# EAGLE design SHIELD_STM32F426ZI (EAGLE 9.5.1)

## Sheet 1 of 2
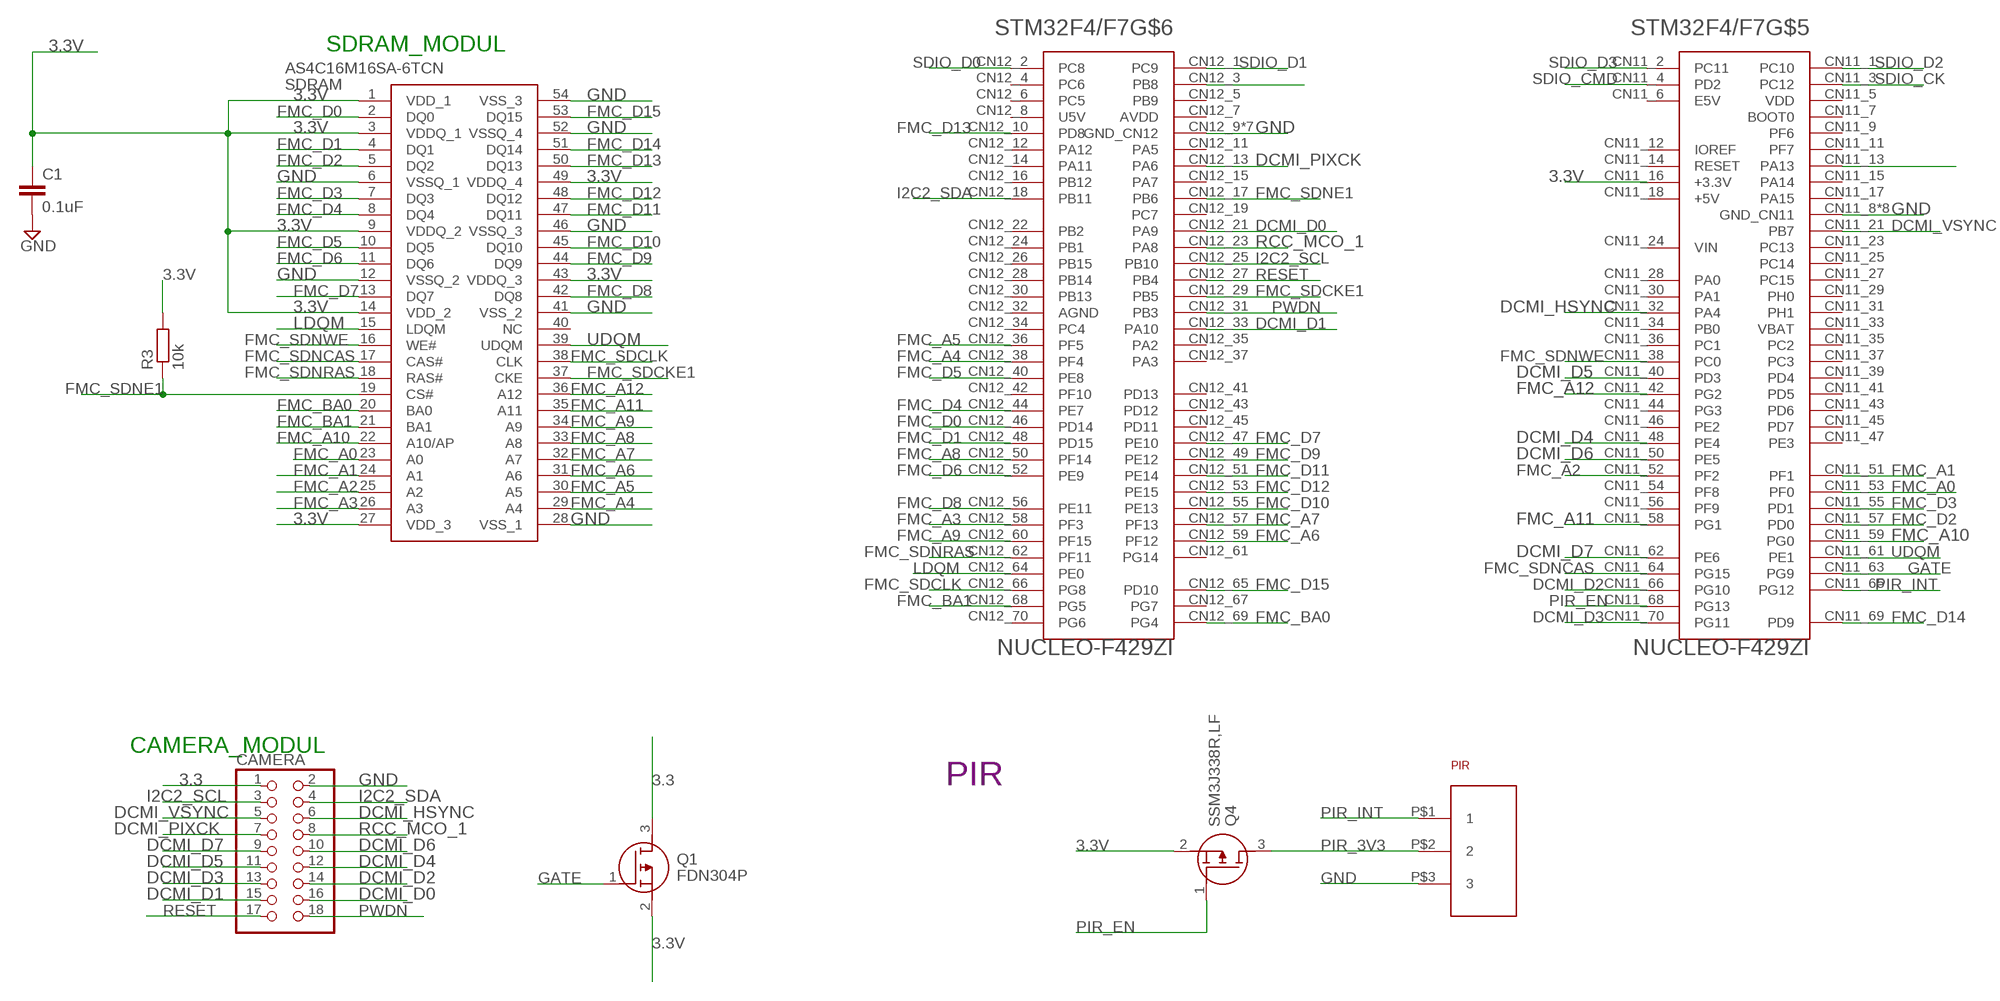
[diagram p0: schematic, sheet 1]

### Parts
C1  0.1uF  C-EUC0402K  [C0402K]
CAMERA  0  PINHD-2X9  [2X09]
PIR  SENBA_PIR_3PIN  [SENBA_PIR]
Q1  FDN304P  [SOT95P237X112-3N]
Q4  SSM3J338R,LF  [SSM3J332RLFT]
R3  10k  R_0402WEB_0402  [C0402K]
SDRAM  AS4C16M16SA-6TCN  [SOP80P1176X120-54N]
STM32F4/F7  NUCLEO-F429ZI  [MODULE_NUCLEO-F429ZI]

### Nets
3.3: CAMERA.1 Q1.3(D)
3.3V: C1.1 Q1.2(S) Q4.2(S) R3.2 SDRAM.1(VDD_1) SDRAM.3(VDDQ_1) SDRAM.9(VDDQ_2) SDRAM.14(VDD_2) SDRAM.27(VDD_3) SDRAM.43(VDDQ_3) SDRAM.49(VDDQ_4) STM32F4/F7.CN11_16(+3.3V) ; also sheet 2
CARD_DET: STM32F4/F7.CN12_3(PB8) ; also sheet 2
DCMI_D0: CAMERA.16 STM32F4/F7.CN12_21(PA9)
DCMI_D1: CAMERA.15 STM32F4/F7.CN12_33(PA10)
DCMI_D2: CAMERA.14 STM32F4/F7.CN11_66(PG10)
DCMI_D3: CAMERA.13 STM32F4/F7.CN11_70(PG11)
DCMI_D4: CAMERA.12 STM32F4/F7.CN11_48(PE4)
DCMI_D5: CAMERA.11 STM32F4/F7.CN11_40(PD3)
DCMI_D6: CAMERA.10 STM32F4/F7.CN11_50(PE5)
DCMI_D7: CAMERA.9 STM32F4/F7.CN11_62(PE6)
DCMI_HSYNC: CAMERA.6 STM32F4/F7.CN11_32(PA4)
DCMI_PIXCK: CAMERA.7 STM32F4/F7.CN12_13(PA6)
DCMI_VSYNC: CAMERA.5 STM32F4/F7.CN11_21(PB7)
FMC_A0: SDRAM.23(A0) STM32F4/F7.CN11_53(PF0)
FMC_A1: SDRAM.24(A1) STM32F4/F7.CN11_51(PF1)
FMC_A2: SDRAM.25(A2) STM32F4/F7.CN11_52(PF2)
FMC_A3: SDRAM.26(A3) STM32F4/F7.CN12_58(PF3)
FMC_A4: SDRAM.29(A4) STM32F4/F7.CN12_38(PF4)
FMC_A5: SDRAM.30(A5) STM32F4/F7.CN12_36(PF5)
FMC_A6: SDRAM.31(A6) STM32F4/F7.CN12_59(PF12)
FMC_A7: SDRAM.32(A7) STM32F4/F7.CN12_57(PF13)
FMC_A8: SDRAM.33(A8) STM32F4/F7.CN12_50(PF14)
FMC_A9: SDRAM.34(A9) STM32F4/F7.CN12_60(PF15)
FMC_A10: SDRAM.22(A10/AP) STM32F4/F7.CN11_59(PG0)
FMC_A11: SDRAM.35(A11) STM32F4/F7.CN11_58(PG1)
FMC_A12: SDRAM.36(A12) STM32F4/F7.CN11_42(PG2)
FMC_BA0: SDRAM.20(BA0) STM32F4/F7.CN12_69(PG4)
FMC_BA1: SDRAM.21(BA1) STM32F4/F7.CN12_68(PG5)
FMC_D0: SDRAM.2(DQ0) STM32F4/F7.CN12_46(PD14)
FMC_D1: SDRAM.4(DQ1) STM32F4/F7.CN12_48(PD15)
FMC_D2: SDRAM.5(DQ2) STM32F4/F7.CN11_57(PD0)
FMC_D3: SDRAM.7(DQ3) STM32F4/F7.CN11_55(PD1)
FMC_D4: SDRAM.8(DQ4) STM32F4/F7.CN12_44(PE7)
FMC_D5: SDRAM.10(DQ5) STM32F4/F7.CN12_40(PE8)
FMC_D6: SDRAM.11(DQ6) STM32F4/F7.CN12_52(PE9)
FMC_D7: SDRAM.13(DQ7) STM32F4/F7.CN12_47(PE10)
FMC_D8: SDRAM.42(DQ8) STM32F4/F7.CN12_56(PE11)
FMC_D9: SDRAM.44(DQ9) STM32F4/F7.CN12_49(PE12)
FMC_D10: SDRAM.45(DQ10) STM32F4/F7.CN12_55(PE13)
FMC_D11: SDRAM.47(DQ11) STM32F4/F7.CN12_51(PE14)
FMC_D12: SDRAM.48(DQ12) STM32F4/F7.CN12_53(PE15)
FMC_D13: SDRAM.50(DQ13) STM32F4/F7.CN12_10(PD8)
FMC_D14: SDRAM.51(DQ14) STM32F4/F7.CN11_69(PD9)
FMC_D15: SDRAM.53(DQ15) STM32F4/F7.CN12_65(PD10)
FMC_SDCKE1: SDRAM.37(CKE) STM32F4/F7.CN12_29(PB5)
FMC_SDCLK: SDRAM.38(CLK) STM32F4/F7.CN12_66(PG8)
FMC_SDNCAS: SDRAM.17(CAS#) STM32F4/F7.CN11_64(PG15)
FMC_SDNE1: R3.1 SDRAM.19(CS#) STM32F4/F7.CN12_17(PB6)
FMC_SDNRAS: SDRAM.18(RAS#) STM32F4/F7.CN12_62(PF11)
FMC_SDNWE: SDRAM.16(WE#) STM32F4/F7.CN11_38(PC0)
GATE: Q1.1(G) STM32F4/F7.CN11_63(PG9)
GND: C1.2 CAMERA.2 PIR.P$3 SDRAM.6(VSSQ_1) SDRAM.12(VSSQ_2) SDRAM.28(VSS_1) SDRAM.41(VSS_2) SDRAM.46(VSSQ_3) SDRAM.52(VSSQ_4) SDRAM.54(VSS_3) STM32F4/F7.CN11_8(GND_CN11) STM32F4/F7.CN11_19(GND_CN11) STM32F4/F7.CN11_20(GND_CN11) STM32F4/F7.CN11_22(GND_CN11) STM32F4/F7.CN11_49(GND_CN11) STM32F4/F7.CN11_60(GND_CN11) STM32F4/F7.CN11_71(GND_CN11) STM32F4/F7.CN11_72(GND_CN11) STM32F4/F7.CN12_9(GND_CN12) STM32F4/F7.CN12_20(GND_CN12) STM32F4/F7.CN12_39(GND_CN12) STM32F4/F7.CN12_54(GND_CN12) STM32F4/F7.CN12_63(GND_CN12) STM32F4/F7.CN12_71(GND_CN12) STM32F4/F7.CN12_72(GND_CN12) ; also sheet 2
I2C2_SCL: CAMERA.3 STM32F4/F7.CN12_25(PB10) ; also sheet 2
I2C2_SDA: CAMERA.4 STM32F4/F7.CN12_18(PB11) ; also sheet 2
LDQM: SDRAM.15(LDQM) STM32F4/F7.CN12_64(PE0)
MOSFET_SDCARD: STM32F4/F7.CN11_13(PA13) ; also sheet 2
PIR_3V3: PIR.P$2 Q4.3(D)
PIR_EN: Q4.1(G) STM32F4/F7.CN11_68(PG13)
PIR_INT: PIR.P$1 STM32F4/F7.CN11_65(PG12)
PWDN: CAMERA.18 STM32F4/F7.CN12_31(PB3)
RCC_MCO_1: CAMERA.8 STM32F4/F7.CN12_23(PA8)
RESET: CAMERA.17 STM32F4/F7.CN12_27(PB4)
SDIO_CK: STM32F4/F7.CN11_3(PC12) ; also sheet 2
SDIO_CMD: STM32F4/F7.CN11_4(PD2) ; also sheet 2
SDIO_D0: STM32F4/F7.CN12_2(PC8) ; also sheet 2
SDIO_D1: STM32F4/F7.CN12_1(PC9) ; also sheet 2
SDIO_D2: STM32F4/F7.CN11_1(PC10) ; also sheet 2
SDIO_D3: STM32F4/F7.CN11_2(PC11) ; also sheet 2
UDQM: SDRAM.39(UDQM) STM32F4/F7.CN11_61(PE1)
Unconnected: SDRAM.40(NC) STM32F4/F7.CN11_5(VDD) STM32F4/F7.CN11_6(E5V) STM32F4/F7.CN11_7(BOOT0) STM32F4/F7.CN11_9(PF6) STM32F4/F7.CN11_11(PF7) STM32F4/F7.CN11_12(IOREF) STM32F4/F7.CN11_14(RESET) STM32F4/F7.CN11_15(PA14) STM32F4/F7.CN11_17(PA15) STM32F4/F7.CN11_18(+5V) STM32F4/F7.CN11_23(PC13) STM32F4/F7.CN11_24(VIN) STM32F4/F7.CN11_25(PC14) STM32F4/F7.CN11_27(PC15) STM32F4/F7.CN11_28(PA0) STM32F4/F7.CN11_29(PH0) STM32F4/F7.CN11_30(PA1) STM32F4/F7.CN11_31(PH1) STM32F4/F7.CN11_33(VBAT) STM32F4/F7.CN11_34(PB0) STM32F4/F7.CN11_35(PC2) STM32F4/F7.CN11_36(PC1) STM32F4/F7.CN11_37(PC3) STM32F4/F7.CN11_39(PD4) STM32F4/F7.CN11_41(PD5) STM32F4/F7.CN11_43(PD6) STM32F4/F7.CN11_44(PG3) STM32F4/F7.CN11_45(PD7) STM32F4/F7.CN11_46(PE2) STM32F4/F7.CN11_47(PE3) STM32F4/F7.CN11_54(PF8) STM32F4/F7.CN11_56(PF9) STM32F4/F7.CN12_4(PC6) STM32F4/F7.CN12_5(PB9) STM32F4/F7.CN12_6(PC5) STM32F4/F7.CN12_7(AVDD) STM32F4/F7.CN12_8(U5V) STM32F4/F7.CN12_11(PA5) STM32F4/F7.CN12_12(PA12) STM32F4/F7.CN12_14(PA11) STM32F4/F7.CN12_15(PA7) STM32F4/F7.CN12_16(PB12) STM32F4/F7.CN12_19(PC7) STM32F4/F7.CN12_22(PB2) STM32F4/F7.CN12_24(PB1) STM32F4/F7.CN12_26(PB15) STM32F4/F7.CN12_28(PB14) STM32F4/F7.CN12_30(PB13) STM32F4/F7.CN12_32(AGND) STM32F4/F7.CN12_34(PC4) STM32F4/F7.CN12_35(PA2) STM32F4/F7.CN12_37(PA3) STM32F4/F7.CN12_41(PD13) STM32F4/F7.CN12_42(PF10) STM32F4/F7.CN12_43(PD12) STM32F4/F7.CN12_45(PD11) STM32F4/F7.CN12_61(PG14) STM32F4/F7.CN12_67(PG7) STM32F4/F7.CN12_70(PG6)

### Notes on the sheet
- SDRAM_MODUL
- CAMERA_MODUL
- PIR

## Sheet 2 of 2: SDCARD
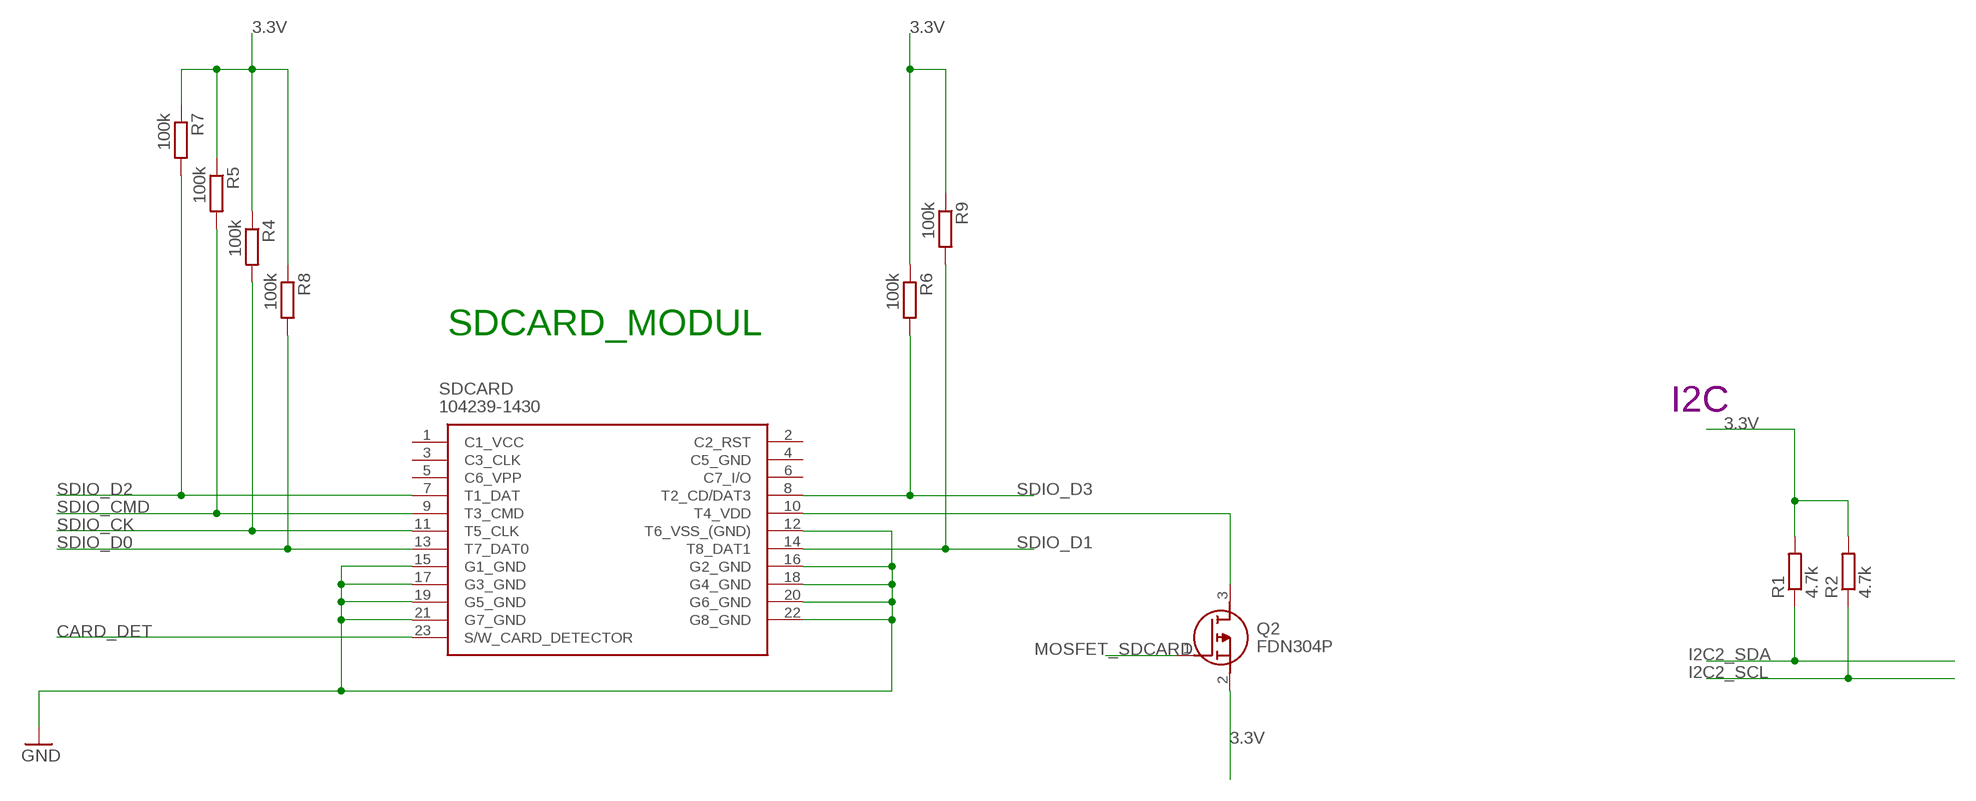
[diagram p1: schematic, sheet 2]

### Parts
Q2  FDN304P  [SOT95P237X112-3N]
R1  4.7k  R_0402WEB_0402  [C0402K]
R2  4.7k  R_0402WEB_0402  [C0402K]
R4  100k  R-EU_R0402  [R0402]
R5  100k  R-EU_R0402  [R0402]
R6  100k  R-EU_R0402  [R0402]
R7  100k  R-EU_R0402  [R0402]
R8  100k  R-EU_R0402  [R0402]
R9  100k  R-EU_R0402  [R0402]
SDCARD  104239-1430  [1042391430]

### Nets
3.3V: Q2.2(S) R1.2 R2.2 R4.1 R5.1 R6.1 R7.1 R8.1 R9.1 ; also sheet 1
CARD_DET: SDCARD.23(S/W_CARD_DETECTOR) ; also sheet 1
GND: SDCARD.12(T6_VSS_(GND)) SDCARD.15(G1_GND) SDCARD.16(G2_GND) SDCARD.17(G3_GND) SDCARD.18(G4_GND) SDCARD.19(G5_GND) SDCARD.20(G6_GND) SDCARD.21(G7_GND) SDCARD.22(G8_GND) ; also sheet 1
I2C2_SCL: R2.1 ; also sheet 1
I2C2_SDA: R1.1 ; also sheet 1
MOSFET_SDCARD: Q2.1(G) ; also sheet 1
N$1: Q2.3(D) SDCARD.10(T4_VDD)
SDIO_CK: R4.2 SDCARD.11(T5_CLK) ; also sheet 1
SDIO_CMD: R5.2 SDCARD.9(T3_CMD) ; also sheet 1
SDIO_D0: R8.2 SDCARD.13(T7_DAT0) ; also sheet 1
SDIO_D1: R9.2 SDCARD.14(T8_DAT1) ; also sheet 1
SDIO_D2: R7.2 SDCARD.7(T1_DAT) ; also sheet 1
SDIO_D3: R6.2 SDCARD.8(T2_CD/DAT3) ; also sheet 1
Unconnected: SDCARD.1(C1_VCC) SDCARD.2(C2_RST) SDCARD.3(C3_CLK) SDCARD.4(C5_GND) SDCARD.5(C6_VPP) SDCARD.6(C7_I/O)

### Notes on the sheet
- SDCARD_MODUL
- I2C

## Library data of the parts
C1 = rcl:C-EU: CAPACITOR, European symbol; SPICEPREFIX: C
CAMERA = pinhead:PINHD-2X9: PIN HEADER
PIR = sicom_universal:SENBA_PIR_3PIN
Q1 Q2 = FDN304P:FDN304P: FDN304P P-Channel MOSFET, 2.4 A, 20 V PowerTrench, 3-Pin SOT-23 ON Semiconductor Source: Datasheet <https://componentsearchengine.com/Datasheets/1/FDN304P.pdf>; DESCRIPTION: FDN304P P-Channel MOSFET, 2.4 A, 20 V PowerTrench, 3-Pin SOT-23 ON Semiconductor; HEIGHT: 1.12mm; MANUFACTURER_NAME: ON Semiconductor; MANUFACTURER_PART_NUMBER: FDN304P; MOUSER_PART_NUMBER: 512-FDN304P; MOUSER_PRICE-STOCK: https://www.mouser.com/Search/Refine.aspx?Keyword=512-FDN304P
Q4 = SamacSys_Parts:SSM3J338R,LF: MOSFET Small-signal MOSFET Vdss= -12V, ID= -6A Source: Datasheet <https://componentsearchengine.com/Datasheets/1/SSM3J338R,LF.pdf>; DESCRIPTION: MOSFET Small-signal MOSFET Vdss= -12V, ID= -6A; HEIGHT: mm; MANUFACTURER_NAME: Toshiba; MANUFACTURER_PART_NUMBER: SSM3J338R,LF; MOUSER_PART_NUMBER: 757-SSM3J338RLF
R1-R3 = sicom_universal:R_0402
R4-R9 = rcl:R-EU_: RESISTOR, European symbol; SPICEPREFIX: R
SDCARD = SamacSys_Parts:104239-1430: Molex 104239 Series 6 (Nano SD), 8 (microSD) Way MicroSD, Nano SIM Memory Card Connector with Solder Termination Source: Datasheet <https://componentsearchengine.com/Datasheets/1/104239-1430.pdf>; DESCRIPTION: Molex 104239 Series 6 (Nano SD), 8 (microSD) Way MicroSD, Nano SIM Memory Card Connector with Solder Termination; HEIGHT: 2mm; MANUFACTURER_NAME: Molex; MANUFACTURER_PART_NUMBER: 104239-1430; MOUSER_PART_NUMBER: 538-104239-1430
SDRAM = sdram:AS4C16M16SA-6TCN: 256M (16Mx16bit) Synchronous DRAM (SDRAM) Source: Datasheet <https://componentsearchengine.com/Datasheets/1/AS4C16M16SA-6TCN.pdf>; DESCRIPTION: 256M (16Mx16bit) Synchronous DRAM (SDRAM); HEIGHT: 1.2mm; MANUFACTURER_NAME: Alliance Memory; MANUFACTURER_PART_NUMBER: AS4C16M16SA-6TCN; MOUSER_PART_NUMBER: 913-4C16M16SA-6TCN; MOUSER_PRICE-STOCK: https://www.mouser.com/Search/Refine.aspx?Keyword=913-4C16M16SA-6TCN
STM32F4/F7 = NUCLEO-F429ZI:NUCLEO-F429ZI: STM32 Nucleo-144 development board with STM32F429ZIT6 MCU, supports Arduino, ST Zio and Morpho; AVAILABILITY: Unavailable; DESCRIPTION: STM32 Nucleo-144 development board with STM32F429ZIT6 MCU, supports Arduino, ST Zio and Morpho; MF: STMicroelectronics; MP: NUCLEO-F429ZI; PACKAGE: None; PRICE: None

## Board
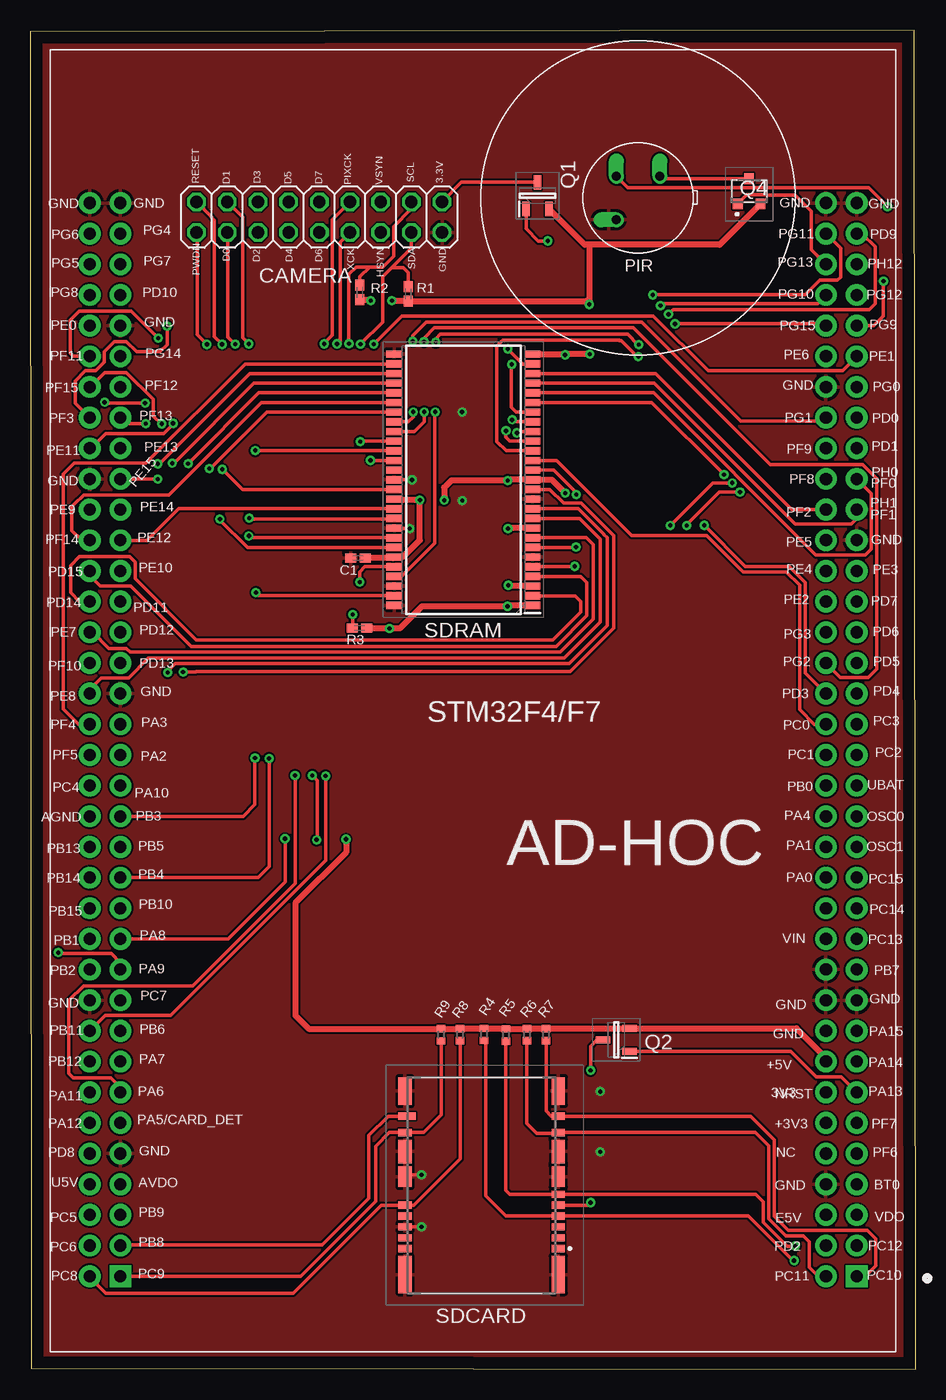
[diagram p2: board, top side]
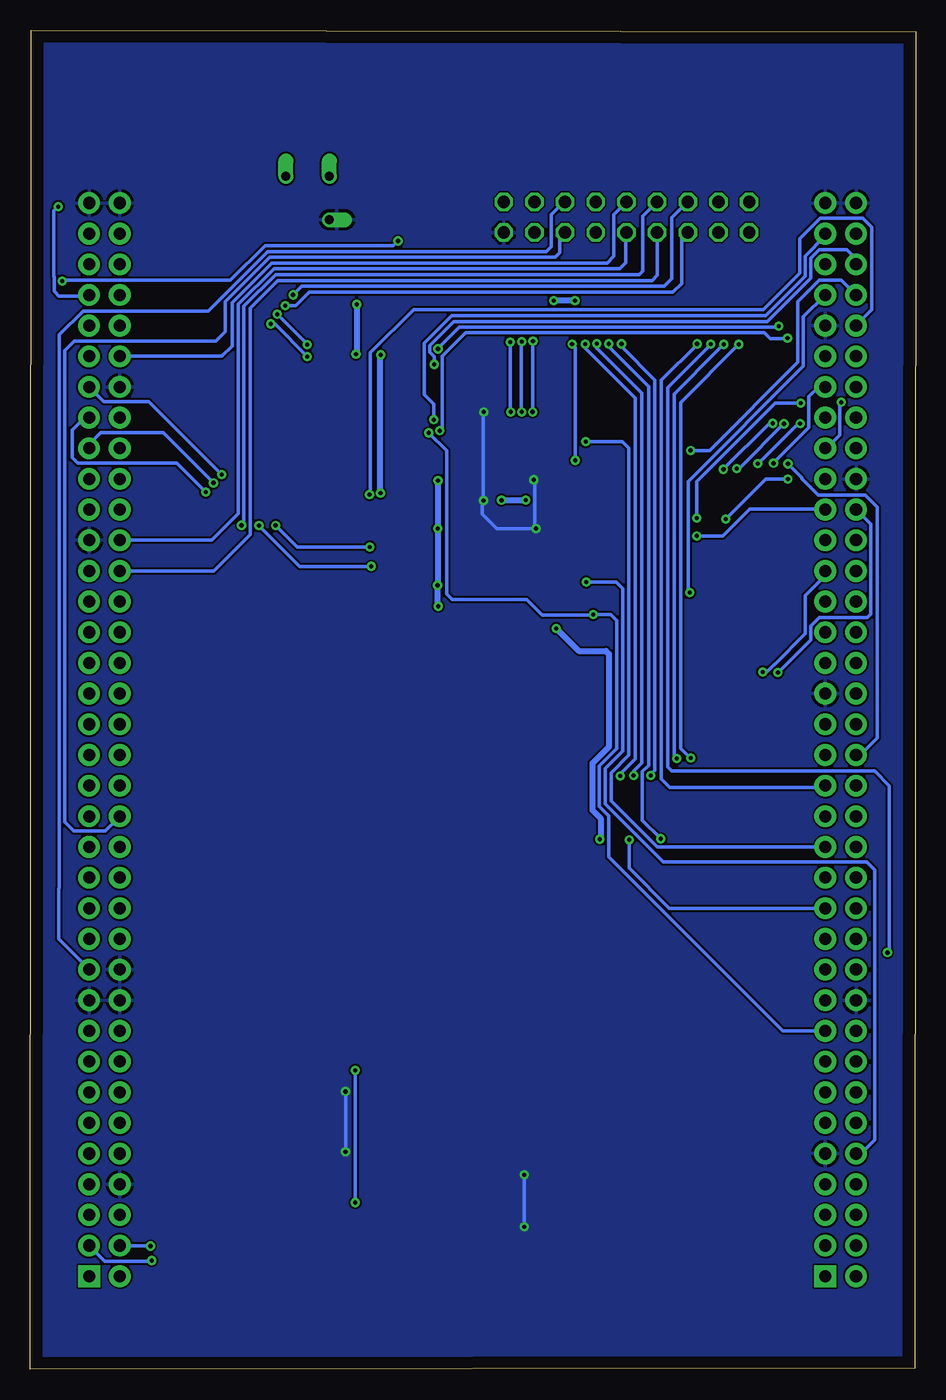
[diagram p3: board, bottom side, seen from below]

Size 73.31 x 110.92 mm. Coordinates in mm from the lower left corner, seen from the top.
Outline: 0.08,0.1 73.31,0 73.22,110.92 0,110.81 0.08,0.1
Copper layers (1*16): Top 0.035mm / dielectric 1.5mm / Bottom 0.035mm
Design rules "default": minimum track width 6mil, minimum drill 0.35mm, track to track 6mil, track to pad 6mil, pad to pad 6mil, via to via 6mil, smd to smd 6mil, copper to edge 40mil, drill to drill 6mil, minimum pad ring 10mil, minimum via ring 8mil, stop-mask expansion 4mil, vias tented up to drill 0mil, thermal gap 10mil

### Footprints (pad centres in the part's own frame; a part is rotated, then mirrored left to right if it is on the bottom)
C0402K = smd 0.925 x 0.74: 1 -0.6,0; 2 0.6,0
2X09 = drill 1.016 octagon: 1 -10.16,-1.27; 2 -10.16,1.27; 3 -7.62,-1.27; 4 -7.62,1.27; 5 -5.08,-1.27; 6 -5.08,1.27; 7 -2.54,-1.27; 8 -2.54,1.27; 9 0,-1.27; 10 0,1.27; 11 2.54,-1.27; 12 2.54,1.27; 13 5.08,-1.27; 14 5.08,1.27; 15 7.62,-1.27; 16 7.62,1.27; 17 10.16,-1.27; 18 10.16,1.27
SENBA_PIR = drill 0.75 offset: P$1 1.8,-1.8; P$2 -1.8,-1.8; P$3 1.8,1.8
SOT95P237X112-3N = smd 1.2 x 0.6: 1 -1.1,0.95; 2 -1.1,-0.95; 3 1.1,0
SSM3J332RLFT = smd 0.8 x 0.9: 1 -0.95,-1.05; 2 0.95,-1.05; 3 0,1.05
R0402 = smd 0.6 x 0.7: 1 -0.5,0; 2 0.5,0
1042391430 = smd 1.1 x 0.6: 1 6.35,3.7; 2 6.35,4.6; 3 -6.35,3.7; 4 6.35,5.5; 5 -6.35,4.6; 6 -6.35,6.4; 7 6.35,14.665; 8 6.35,13.31; 9 6.35,8.2; 10 6.35,7.3; 11 6.35,6.4; 12 -6.35,5.5; 13 -6.35,7.3; 14 -6.35,13.31 | smd 1.1 x 3.1: 15 -6.35,1.55; 22 6.35,1.55 | smd 1.1 x 1.72: 16 -6.35,9.66; 21 6.35,9.66 | smd 1.1 x 1.94: 17 -6.35,11.74; 20 6.35,11.74 | smd 1.1 x 2.3: 18 -6.35,16.75; 19 6.35,16.75 | smd 1.45 x 0.6: 23 -6.175,14.665
SOP80P1176X120-54N = smd 1.295 x 0.6: 1 -5.728,10.4; 2 -5.728,9.6; 3 -5.728,8.8; 4 -5.728,8; 5 -5.728,7.2; 6 -5.728,6.4; 7 -5.728,5.6; 8 -5.728,4.8; 9 -5.728,4; 10 -5.728,3.2; 11 -5.728,2.4; 12 -5.728,1.6; 13 -5.728,0.8; 14 -5.728,0; 15 -5.728,-0.8; 16 -5.728,-1.6; 17 -5.728,-2.4; 18 -5.728,-3.2; 19 -5.728,-4; 20 -5.728,-4.8; 21 -5.728,-5.6; 22 -5.728,-6.4; 23 -5.728,-7.2; 24 -5.728,-8; 25 -5.728,-8.8; 26 -5.728,-9.6; 27 -5.728,-10.4; 28 5.728,-10.4; 29 5.728,-9.6; 30 5.728,-8.8; 31 5.728,-8; 32 5.728,-7.2; 33 5.728,-6.4; 34 5.728,-5.6; 35 5.728,-4.8; 36 5.728,-4; 37 5.728,-3.2; 38 5.728,-2.4; 39 5.728,-1.6; 40 5.728,-0.8; 41 5.728,0; 42 5.728,0.8; 43 5.728,1.6; 44 5.728,2.4; 45 5.728,3.2; 46 5.728,4; 47 5.728,4.8; 48 5.728,5.6; 49 5.728,6.4; 50 5.728,7.2; 51 5.728,8; 52 5.728,8.8; 53 5.728,9.6; 54 5.728,10.4
MODULE_NUCLEO-F429ZI = drill 1 pad 1.8 square: CN11_1 -31.75,45.09; CN12_1 29.21,45.09 | drill 1 pad 1.8: CN11_2 -29.21,45.09; CN11_3 -31.75,42.55; CN11_4 -29.21,42.55; CN11_5 -31.75,40.01; CN11_6 -29.21,40.01; CN11_7 -31.75,37.47; CN11_8 -29.21,37.47; CN11_9 -31.75,34.93; CN11_10 -29.21,34.93; CN11_11 -31.75,32.39; CN11_12 -29.21,32.39; CN11_13 -31.75,29.85; CN11_14 -29.21,29.85; CN11_15 -31.75,27.31; CN11_16 -29.21,27.31; CN11_17 -31.75,24.77; CN11_18 -29.21,24.77; CN11_19 -31.75,22.23; CN11_20 -29.21,22.23; CN11_21 -31.75,19.69; CN11_22 -29.21,19.69; CN11_23 -31.75,17.15; CN11_24 -29.21,17.15; CN11_25 -31.75,14.61; CN11_26 -29.21,14.61; CN11_27 -31.75,12.07; CN11_28 -29.21,12.07; CN11_29 -31.75,9.53; CN11_30 -29.21,9.53; CN11_31 -31.75,6.99; CN11_32 -29.21,6.99; CN11_33 -31.75,4.45; CN11_34 -29.21,4.45; CN11_35 -31.75,1.91; CN11_36 -29.21,1.91; CN11_37 -31.75,-0.63; CN11_38 -29.21,-0.63; CN11_39 -31.75,-3.17; CN11_40 -29.21,-3.17; CN11_41 -31.75,-5.71; CN11_42 -29.21,-5.71; CN11_43 -31.75,-8.25; CN11_44 -29.21,-8.25; CN11_45 -31.75,-10.79; CN11_46 -29.21,-10.79; CN11_47 -31.75,-13.33; CN11_48 -29.21,-13.33; CN11_49 -31.75,-15.87; CN11_50 -29.21,-15.87; CN11_51 -31.75,-18.41; CN11_52 -29.21,-18.41; CN11_53 -31.75,-20.95; CN11_54 -29.21,-20.95; CN11_55 -31.75,-23.49; CN11_56 -29.21,-23.49; CN11_57 -31.75,-26.03; CN11_58 -29.21,-26.03; CN11_59 -31.75,-28.57; CN11_60 -29.21,-28.57; CN11_61 -31.75,-31.11; CN11_62 -29.21,-31.11; CN11_63 -31.75,-33.65; CN11_64 -29.21,-33.65; CN11_65 -31.75,-36.19; CN11_66 -29.21,-36.19; CN11_67 -31.75,-38.73; CN11_68 -29.21,-38.73; CN11_69 -31.75,-41.27; CN11_70 -29.21,-41.27; CN11_71 -31.75,-43.81; CN11_72 -29.21,-43.81; CN12_2 31.75,45.09; CN12_3 29.21,42.55; CN12_4 31.75,42.55; CN12_5 29.21,40.01; CN12_6 31.75,40.01; CN12_7 29.21,37.47; CN12_8 31.75,37.47; CN12_9 29.21,34.93; CN12_10 31.75,34.93; CN12_11 29.21,32.39; CN12_12 31.75,32.39; CN12_13 29.21,29.85; CN12_14 31.75,29.85; CN12_15 29.21,27.31; CN12_16 31.75,27.31; CN12_17 29.21,24.77; CN12_18 31.75,24.77; CN12_19 29.21,22.23; CN12_20 31.75,22.23; CN12_21 29.21,19.69; CN12_22 31.75,19.69; CN12_23 29.21,17.15; CN12_24 31.75,17.15; CN12_25 29.21,14.61; CN12_26 31.75,14.61; CN12_27 29.21,12.07; CN12_28 31.75,12.07; CN12_29 29.21,9.53; CN12_30 31.75,9.53; CN12_31 29.21,6.99; CN12_32 31.75,6.99; CN12_33 29.21,4.45; CN12_34 31.75,4.45; CN12_35 29.21,1.91; CN12_36 31.75,1.91; CN12_37 29.21,-0.63; CN12_38 31.75,-0.63; CN12_39 29.21,-3.17; CN12_40 31.75,-3.17; CN12_41 29.21,-5.71; CN12_42 31.75,-5.71; CN12_43 29.21,-8.25; CN12_44 31.75,-8.25; CN12_45 29.21,-10.79; CN12_46 31.75,-10.79; CN12_47 29.21,-13.33; CN12_48 31.75,-13.33; CN12_49 29.21,-15.87; CN12_50 31.75,-15.87; CN12_51 29.21,-18.41; CN12_52 31.75,-18.41; CN12_53 29.21,-20.95; CN12_54 31.75,-20.95; CN12_55 29.21,-23.49; CN12_56 31.75,-23.49; CN12_57 29.21,-26.03; CN12_58 31.75,-26.03; CN12_59 29.21,-28.57; CN12_60 31.75,-28.57; CN12_61 29.21,-31.11; CN12_62 31.75,-31.11; CN12_63 29.21,-33.65; CN12_64 31.75,-33.65; CN12_65 29.21,-36.19; CN12_66 31.75,-36.19; CN12_67 29.21,-38.73; CN12_68 31.75,-38.73; CN12_69 29.21,-41.27; CN12_70 31.75,-41.27; CN12_71 29.21,-43.81; CN12_72 31.75,-43.81

### Placement (x,y rotation side)
C1  27.14,67.21 180 top
CAMERA  23.94,95.43 180 top
PIR  50.34,97.02 180 top
Q1  42.01,97.21 90 top
Q2  48.53,27.29 180 top
Q4  59.53,97.58 0 top
R1  31.31,89.08 270 top
R2  27.3,89.2 270 top
R3  27.27,61.41 0 top
R4  37.59,27.75 270 top
R5  39.38,27.69 270 top
R6  41.12,27.72 270 top
R7  42.71,27.72 270 top
R8  35.59,27.72 270 top
R9  34.02,27.71 270 top
SDCARD  37.38,6.3 0 top
SDRAM  35.87,73.68 180 top
STM32F4/F7  36.68,52.8 180 top

### Tracks (layer width: path | path; a pad name or v marks a point on that pad's centre or on a via)
3.3
  Top 0.305: Q1.3 35.71,98.31 CAMERA.1
3.3V  (via drill 0.35)
  Top 0.305: C1.1 27.76,67.19 | 37.63,28.24 R4.1
  Top 0.508: v44.31,72.57 43.2,73.68 SDRAM.14 39.6,73.68 v39.54,73.62 34.87,73.62 34.28,73.04 v34.28,71.99 | 27.76,67.19 30.05,67.19 SDRAM.49 30.86,67.28 32.27,68.68 v32.27,72 30.22,72 SDRAM.43 | Q1.2 45.93,93.14 46.28,93.14 | 46.28,93.14 v46.28,88.21 46.01,88.48 R1.2 29.98,88.48 v29.95,88.51 | Q4.2 57.09,93.14 46.28,93.14 | STM32F4/F7.CN11_16 65.89,25.78 63.43,28.24 Q2.2 49.61,28.22 R7.1 42.66,28.27 42.61,28.22 R6.1 41.09,28.19 R5.1 39.36,28.17 39.28,28.25 R4.1 | 37.63,28.24 37.61,28.22 R8.1 R9.1 23.05,28.21 21.95,29.31 21.95,38.61 26.15,42.81 v26.15,43.91 | SDRAM.9 39.61,69.68 v39.56,69.63 | SDRAM.3 39.65,64.88 v39.59,64.94 | SDRAM.27 44.24,84.08 v44.29,84.03 44.34,84.08 v46.33,84.08 | SDRAM.1 39.6,63.28 v39.52,63.2 32.44,63.2 30.6,61.36 v29.75,61.36 29.7,61.41 R3.2 | R2.2 28.13,88.6 v28.2,88.53
  Bottom 0.305: 29.93,88.53 v29.95,88.51
  Bottom 0.508: v34.28,71.99 v34.27,72 v32.27,72 | v39.54,73.62 39.56,73.6 v39.56,69.63 39.56,64.97 v39.59,64.94 39.59,63.27 v39.52,63.2 | v44.29,84.03 44.31,84.01 v44.31,72.57 | v46.28,88.21 46.28,84.13 v46.33,84.08 | v28.2,88.53 29.93,88.53 | v29.75,61.36 27.9,59.51 25.65,59.51 25.4,59.26 25.4,51.56 26.77,50.19 26.77,46.33 26.07,45.63 26.07,43.98 v26.15,43.91
CARD_DET
  Top 0.305: SDCARD.23 29.65,20.96 28.05,19.36 28.05,14.16 24.2,10.31 7.53,10.31 STM32F4/F7.CN12_3
DCMI_D0  (via drill 0.35)
  Top 0.305: CAMERA.16 16.37,94.11 16.37,85.51 v16.97,84.91 | v2.32,34.52 2.41,34.43 6.71,34.43 7.47,33.67 STM32F4/F7.CN12_21
  Bottom 0.305: v2.32,34.52 2.17,34.67 2.17,48.33 3.4,49.55 20.17,49.55 20.52,49.9 20.52,81.31 16.97,84.86 v16.97,84.91
DCMI_D1  (via drill 0.35)
  Top 0.305: CAMERA.15 17.59,95.43 17.59,85.44 v18.09,84.94
  Bottom 0.305: v18.09,84.94 18.09,84.89 21.04,81.94 21.04,48.89 20.35,48.2 7.62,48.2 STM32F4/F7.CN12_33
DCMI_D2  (via drill 0.35)
  Top 0.305: v52.19,88.1 52.25,88.29 65.19,88.29 STM32F4/F7.CN11_66
  Bottom 0.305: CAMERA.14 19.36,93.66 19.36,89.94 20.09,89.21 50.2,89.21 51.31,88.1 v52.19,88.1
DCMI_D3  (via drill 0.35)
  Top 0.305: v51.54,88.99 64.19,88.99 65.39,90.19 66.82,90.19 67.09,90.47 67.09,92.86 STM32F4/F7.CN11_70
  Bottom 0.305: CAMERA.13 20.17,95.39 20.17,90.35 20.8,89.72 50.82,89.72 v51.54,88.99
DCMI_D4
  Bottom 0.305: CAMERA.12 21.4,90.61 21.82,90.19 52.82,90.19 55.1,87.91 55.1,69.14 58.11,66.13 STM32F4/F7.CN11_48
DCMI_D5  (via drill 0.35)
  Top 0.305: v55.81,69.91 59.21,66.51 62.86,66.51 64.19,65.18 64.19,57.67 STM32F4/F7.CN11_40
  Bottom 0.305: CAMERA.11 22.6,95.5 22.6,90.98 22.9,90.68 52.97,90.68 55.61,88.04 55.61,70.11 v55.81,69.91
DCMI_D6
  Bottom 0.305: CAMERA.10 24.01,94.09 24.01,91.66 24.49,91.18 53.12,91.18 56.07,88.23 56.07,70.89 58.29,68.67 STM32F4/F7.CN11_50
DCMI_D7
  Bottom 0.305: CAMERA.9 25.01,95.63 25.01,92.18 25.55,91.64 53.31,91.64 56.6,88.35 56.6,84.74 57.43,83.91 STM32F4/F7.CN11_62
DCMI_HSYNC
  Bottom 0.305: CAMERA.6 29.47,93.71 29.47,92.5 29.84,92.13 53.46,92.13 57.15,88.44 57.15,85.97 57.95,85.17 69.65,85.17 70.44,84.37 70.44,45.35 69.7,44.6 67.09,44.6 STM32F4/F7.CN11_32
DCMI_PIXCK  (via drill 0.35)
  Top 0.305: v24.35,84.94 24.35,84.99 25,85.64 25,93.59 25.01,93.6 25.01,95.23 CAMERA.7 | v21.93,49.19 21.93,40.26 13.45,31.77 6.97,31.77 6.96,31.76 5.44,31.76 5.43,31.77 4.43,31.77 3.2,30.54 3.2,24.51 3.55,24.16 6.65,24.16 7.47,23.34 STM32F4/F7.CN12_13
  Bottom 0.305: v24.35,84.94 24.35,84.72 21.58,81.95 21.58,49.61 21.93,49.26 v21.93,49.19
DCMI_VSYNC
  Bottom 0.305: CAMERA.5 29.12,96.7 30.18,95.64 30.18,92.98 30.57,92.59 53.65,92.59 58.59,87.66 68.93,87.66 70.9,85.69 70.9,39.87 70.95,39.82 70.95,35.63 STM32F4/F7.CN11_21
FMC_A0
  Top 0.305: SDRAM.23 51.65,80.88 65.06,67.47 69.16,67.47 69.64,67.94 69.64,72.55 STM32F4/F7.CN11_53
FMC_A1
  Top 0.305: SDRAM.24 51.66,81.68 63.34,70 67.98,70 68.43,70.46 STM32F4/F7.CN11_51
FMC_A2
  Top 0.305: SDRAM.25 51.79,82.48 63.06,71.21 STM32F4/F7.CN11_52
FMC_A3  (via drill 0.35)
  Top 0.305: SDRAM.26 40.79,83.28 v39.55,84.52 | STM32F4/F7.CN12_58 3.73,80.03 3.73,81.87 4.56,82.7 5.43,82.7 6.14,83.41 6.14,84.28 6.97,85.11 7.97,85.11 8.81,84.28 10.72,84.28 11.33,84.89 v11.33,86.4
  Bottom 0.305: v39.55,84.52 39.48,84.59 39.48,84.62 37.78,86.32 11.41,86.32 v11.33,86.4
FMC_A4
  Top 0.305: SDRAM.29 17.8,83.28 9.58,75.06 3.66,75.06 2.74,74.14 2.74,54.71 4.02,53.43 STM32F4/F7.CN12_38
FMC_A5  (via drill 0.35)
  Top 0.305: SDRAM.30 18.18,82.48 10.63,74.93 v10.56,75
  Bottom 0.305: STM32F4/F7.CN12_36 4.58,50.89 3.16,52.31 3.16,71.42 4.16,72.42 8.04,72.42 9.43,73.8 9.43,73.87 v10.56,75
FMC_A6  (via drill 0.35)
  Top 0.305: SDRAM.31 18.51,81.68 12.03,75.2 11.92,75.2 v11.77,75.05
  Bottom 0.305: v11.77,75.05 11.32,75.5 11.33,75.5 8.83,78 8.83,80.56 8.02,81.37 STM32F4/F7.CN12_59
FMC_A7  (via drill 0.35)
  Top 0.305: SDRAM.32 18.94,80.88 13.18,75.11 13.16,75.11 v13.08,75.03 | v9.56,78.33 7.97,78.33 STM32F4/F7.CN12_57
  Bottom 0.305: v13.08,75.03 13.03,75.07 12.97,75.07 9.72,78.33 v9.56,78.33
FMC_A8
  Top 0.305: SDRAM.33 29.96,80.08 29.95,80.07 19.12,80.07 11.46,72.42 4.43,72.42 3.67,71.65 3.66,71.65 3.43,71.42 3.43,69.49 4.25,68.67 STM32F4/F7.CN12_50
FMC_A9  (via drill 0.35)
  Top 0.305: SDRAM.34 19.6,79.28 14.92,74.6 v14.82,74.6 | STM32F4/F7.CN12_60 4.99,81.37 6.19,82.58 7.97,82.58 10.2,80.35 10.2,78.97 10.85,78.31 v10.9,78.31
  Bottom 0.305: v10.9,78.31 14.51,74.7 14.72,74.7 v14.82,74.6
FMC_A10  (via drill 0.35)
  Top 0.305: v57.45,74.11 51.48,80.08 SDRAM.22
  Bottom 0.305: v57.45,74.11 63.51,80.17 66.5,80.17 67.23,80.17 STM32F4/F7.CN11_59
FMC_A11  (via drill 0.35)
  Top 0.305: SDRAM.35 31.31,78.48 31.71,78.88 v31.71,79.3 | STM32F4/F7.CN11_58 65.62,78.56 58.82,78.56 50.64,86.73 32.81,86.73 31.68,85.6 v31.68,85.16
  Bottom 0.305: v31.71,79.3 31.71,85.13 v31.68,85.16
FMC_A12  (via drill 0.35)
  Top 0.305: SDRAM.36 31.79,77.68 32.62,78.51 v32.62,79.3 | STM32F4/F7.CN11_42 67.09,57.31 67.93,57.31 67.93,57.3 69.4,57.3 70.09,58 70.09,73.8 69.82,74.07 69.81,74.07 68.93,74.95 61.27,74.95 49.95,86.27 33.47,86.27 32.61,85.41 v32.61,85.12
  Bottom 0.305: v32.61,85.12 32.65,85.08 32.65,79.33 v32.62,79.3
FMC_BA0  (via drill 0.35)
  Top 0.305: SDRAM.20 40.07,78.48 v39.9,78.65
  Bottom 0.305: v39.9,78.65 39.9,79.95 40.69,80.74 40.69,84.99 38.4,87.28 12.41,87.28 9.13,90.55 9.13,92.22 7.47,93.88 STM32F4/F7.CN12_69
FMC_BA1  (via drill 0.35)
  Top 0.305: SDRAM.21 40.24,79.28 39.82,79.7 39.82,83.19 v39.86,83.24
  Bottom 0.305: v39.86,83.24 39.86,83.87 40.23,84.23 40.23,84.8 38.26,86.77 12.27,86.77 8.68,90.36 8.68,92.03 7.97,92.73 6.97,92.73 5.68,92.73 4.93,91.98 STM32F4/F7.CN12_68
FMC_D0
  Top 0.305: SDRAM.2 41.65,64.03 45.13,64.03 45.57,63.59 45.57,62.71 43.28,60.42 13.76,60.42 8.7,65.48 8.7,66.87 8.24,67.33 4.43,67.33 4.42,67.32 4.08,67.32 3.35,66.59 3.35,64.32 4.08,63.59 STM32F4/F7.CN12_46
FMC_D1
  Top 0.305: SDRAM.4 45.59,65.68 46.09,65.18 46.09,62.42 43.56,59.89 13.32,59.89 8.32,64.89 5.82,64.89 4.93,65.78 STM32F4/F7.CN12_48
FMC_D2  (via drill 0.35)
  Top 0.305: SDRAM.5 45.05,66.48 v45.08,66.51 | v54.37,69.89 54.37,69.97 57.07,72.67 v58.77,72.67
  Bottom 0.305: v45.08,66.51 50.98,66.51 v54.37,69.89 | v58.77,72.67 61.16,75.07 69.37,75.07 69.83,75.53 69.83,77.79 68.79,78.83 STM32F4/F7.CN11_57
FMC_D3  (via drill 0.35)
  Top 0.305: SDRAM.7 45.17,68.08 v45.19,68.1 | v52.99,69.9 56.51,73.42 v58.13,73.42
  Bottom 0.305: v45.19,68.1 51.19,68.1 v52.99,69.9 | v58.13,73.42 62.28,77.57 67.47,77.57 68.43,76.61 STM32F4/F7.CN11_55
FMC_D4
  Top 0.305: SDRAM.8 46.05,68.88 46.62,68.31 46.62,62.15 43.88,59.41 8.27,59.41 7.97,59.71 6.52,59.71 5.18,61.05 STM32F4/F7.CN12_44
FMC_D5
  Top 0.305: SDRAM.10 45.51,70.48 47.21,68.78 47.21,61.9 44.22,58.91 9.77,58.91 8.14,57.28 5.89,57.28 4.93,56.32 STM32F4/F7.CN12_40
FMC_D6  (via drill 0.35)
  Top 0.305: SDRAM.11 45.38,71.28 47.49,69.17 47.49,69.15 47.76,68.88 47.76,61.59 44.62,58.45 12.02,58.45 11.4,57.83 v11.4,57.71
  Bottom 0.305: STM32F4/F7.CN12_52 3.73,70 3.73,62.55 4.02,62.26 7.97,62.26 8.68,61.55 8.68,60.42 v11.39,57.71 v11.4,57.71
FMC_D7  (via drill 0.35)
  Top 0.305: SDRAM.13 43.03,72.88 44.18,71.74 45.62,71.74 48.31,69.05 48.31,61.4 44.71,57.79 13.74,57.79 13.71,57.77 v12.66,57.77
  Bottom 0.305: STM32F4/F7.CN12_47 7.47,65.74 9.13,64.08 9.13,60.94 11.68,58.39 12.31,57.77 v12.66,57.77
FMC_D8  (via drill 0.35)
  Top 0.305: SDRAM.42 17.58,72.88 v15.91,74.55 | v11.83,78.35 11.83,78.28 11.04,77.5 6.28,77.5 5.07,76.29 STM32F4/F7.CN12_56
  Bottom 0.305: v15.91,74.55 12.11,78.35 v11.83,78.35
FMC_D9
  Top 0.305: SDRAM.44 12.28,71.28 9.65,68.65 7.49,68.65 STM32F4/F7.CN12_49
FMC_D10  (via drill 0.35)
  Top 0.305: v9.51,80.04 v9.51,80.03 6.23,80.03 v6.16,80.1 | SDRAM.45 30.09,70.43 18.22,70.43 v18.13,70.52
  Bottom 0.305: v9.51,80.04 11.61,80.04 18.13,73.52 v18.13,70.52 | v6.16,80.1 6.27,80 6.27,78.33 6.27,77.38 7.36,76.29 STM32F4/F7.CN12_55
FMC_D11  (via drill 0.35)
  Top 0.305: SDRAM.47 18.26,68.88 v18.11,69.03
  Bottom 0.305: v18.11,69.03 15.98,69.03 13.75,71.26 7.52,71.26 STM32F4/F7.CN12_51
FMC_D12  (via drill 0.35)
  Top 0.305: SDRAM.48 30.11,68.05 18.02,68.05 15.71,70.36 v15.71,70.44 | STM32F4/F7.CN12_53 v10.56,73.75 v10.57,73.74
  Bottom 0.305: v10.57,73.74 12.41,73.74 v15.71,70.44
FMC_D13  (via drill 0.35)
  Top 0.305: SDRAM.50 27.72,66.48 27.27,66.04 v27.27,65.22 v27.28,65.22
  Bottom 0.305: STM32F4/F7.CN12_10 4.49,17.87 3.37,18.99 3.37,41.36 4.02,42.01 20.88,42.01 25.68,46.81 25.68,49.78 24.25,51.21 24.25,64.69 24.78,65.22 v27.28,65.22
FMC_D14  (via drill 0.35)
  Top 0.305: SDRAM.51 30.72,65.67 33.48,68.44 33.48,79.25 v33.53,79.3 | v50.38,84.87 50.32,84.87 49.46,85.73 33.96,85.73 33.57,85.34 v33.57,85.09 | v52.85,87.39 53.24,87.78 69.48,87.78 69.95,88.25 69.95,92.98 68.86,94.07 STM32F4/F7.CN11_69
  Bottom 0.305: v33.53,79.3 33.56,79.33 v33.56,85.08 v33.57,85.09 | v50.38,84.87 50.38,84.92 v52.85,87.39
FMC_D15  (via drill 0.35)
  Top 0.305: SDRAM.53 18.94,64.08 v18.69,64.33
  Bottom 0.305: STM32F4/F7.CN12_65 7.49,88.99 9.29,87.19 9.29,83.1 18.84,73.55 18.84,64.48 v18.69,64.33
FMC_SDCKE1  (via drill 0.35)
  Top 0.305: SDRAM.37 27.35,76.88 v27.32,76.85
  Bottom 0.305: v27.32,76.85 24.27,76.85 23.74,76.32 23.74,50.88 23.74,50.87 25.2,49.41 25.2,47.08 21.39,43.27 STM32F4/F7.CN12_29
FMC_SDCLK  (via drill 0.35)
  Top 0.305: SDRAM.38 18.66,76.08 v18.63,76.11
  Bottom 0.305: STM32F4/F7.CN12_66 6.14,90.19 7.97,90.19 9.74,88.42 9.74,83.41 17.04,76.11 v18.63,76.11
FMC_SDNCAS  (via drill 0.35)
  Top 0.305: SDRAM.17 39.43,76.08 38.65,76.86 38.65,84.76 39.12,85.23 48.78,85.23 48.79,85.22 48.94,85.22 50.28,83.88 v50.36,83.88 | v53.39,86.59 65.75,86.59 STM32F4/F7.CN11_64
  Bottom 0.305: v53.39,86.59 53.07,86.59 v50.36,83.88
FMC_SDNE1  (via drill 0.35)
  Top 0.305: v40.3,77.56 40.42,77.68 SDRAM.19 | v26.7,62.51 26.7,61.44 R3.1
  Bottom 0.305: v40.3,77.56 38.82,76.08 38.82,64.23 38.35,63.76 32.2,63.76 30.9,62.46 26.75,62.46 v26.7,62.51 25.25,62.51 24.76,62.02 24.76,51.41 26.21,49.96 26.21,46.62 25.42,45.83 25.42,42.46 10.99,28.03 STM32F4/F7.CN12_17
FMC_SDNRAS  (via drill 0.35)
  Top 0.305: SDRAM.18 39.72,76.88 39.39,77.21 v39.39,77.74 | v10.61,85.42 8.38,87.66 4.04,87.66 3.3,86.91 3.3,84.19 3.58,83.91 STM32F4/F7.CN12_62
  Bottom 0.305: v39.39,77.74 39.18,77.95 39.18,83.92 37.24,85.86 12.54,85.86 12.05,85.37 10.66,85.37 v10.61,85.42
FMC_SDNWE
  Top 0.305: STM32F4/F7.CN11_38 64.93,53.43 63.7,54.66 63.7,64.96 62.61,66.05 59.02,66.05 56.01,69.06 49.8,69.06 43.58,75.28 SDRAM.16
GATE  (via drill 0.35)
  Top 0.305: Q1.1 41.06,94.46 42.06,93.46 v42.86,93.46 | v70.65,90.13 70.65,87.24 69.86,86.45 STM32F4/F7.CN11_63
  Bottom 0.305: v42.86,93.46 43.23,93.09 53.84,93.09 56.73,90.19 70.59,90.19 v70.65,90.13
GND  (via drill 0.35)
  Top 0.305: SDRAM.41 v31.61,73.68 | v31.43,69.65 30.17,69.65 SDRAM.46 | SDCARD.16 31.18,16.11 v32.4,16.11 | v32.4,11.81 v32.39,11.8 SDCARD.12
  Bottom 0.305: v31.61,73.68 31.53,73.6 31.53,69.75 v31.43,69.65 34.68,69.65 35.88,70.85 35.88,71.8 35.78,71.9 v35.78,71.95 35.78,79.28 v35.76,79.3 | v47.2,23.01 v47.2,18.01 | v32.4,16.11 v32.4,11.81
  pour Bottom: 73.19,110.68 73.19,0.27 73.09,0.17 0.23,0.17 0.19,0.21 0.19,110.61 0.13,110.67 0.12,110.67
  pour Top: 0.17,110.65 73.08,110.65 73.12,110.61 73.12,0.25 73.06,0.19 0.29,0.19 0.2,0.28 0.2,110.62
I2C2_SCL  (via drill 0.35)
  Top 0.305: CAMERA.3 31.56,96.12 30.09,94.65 30.09,92.2 29.2,91.31 28.1,91.31 | 28.1,91.31 27.3,90.51 R2.1 | v26.4,84.96 26.4,90.71 27,91.31 28.1,91.31 | v23.71,43.86 23.75,43.9 23.75,48.78 v23.35,49.18
  Bottom 0.305: v26.4,84.96 26.4,84.58 22.68,80.86 22.68,50.24 23.35,49.57 v23.35,49.18 | v23.71,43.86 23.71,41.51 20.39,38.19 STM32F4/F7.CN12_25
I2C2_SDA  (via drill 0.35)
  Top 0.305: CAMERA.4 31.56,92.87 29.95,91.26 | v27.34,84.92 29.18,86.76 29.18,90.5 29.95,91.26 | v24.46,49.15 24.46,42.14 11.63,29.31 6.21,29.31 STM32F4/F7.CN12_18 | R1.1 31.31,90.83 30.88,91.26 29.95,91.26
  Bottom 0.305: v27.34,84.92 27.34,84.58 23.23,80.46 23.23,50.54 24.46,49.31 v24.46,49.15
LDQM  (via drill 0.35)
  Top 0.305: v45.22,72.45 45.22,72.63 43.37,74.48 SDRAM.15
  Bottom 0.305: v45.22,72.45 45.14,72.53 45.14,84.21 41.56,87.78 12.6,87.78 9.59,90.79 9.59,93.66 7.88,95.36 4.37,95.36 3.61,94.61 3.61,87.77 STM32F4/F7.CN12_64
MOSFET_SDCARD
  Top 0.305: Q2.1 62.97,26.34 65.1,24.21 67.17,24.21 STM32F4/F7.CN11_13
N$1  (via drill 0.35)
  Top 0.305: SDCARD.10 46.17,13.59 v46.4,13.82 | v46.4,24.76 46.4,26.76 46.93,27.29 Q2.3
  Bottom 0.305: v46.4,24.76 v46.4,13.82
PIR_3V3
  Top 0.305: Q4.3 52.33,98.63 PIR.P$2
PIR_EN
  Top 0.305: STM32F4/F7.CN11_68 64.68,92.74 64.68,95.93 63.36,97.25 61.04,97.25 61.01,97.28 59.34,97.28 Q4.1
PIR_INT  (via drill 0.35)
  Top 0.305: v70.99,96.3 69.42,97.88 49.48,97.88 PIR.P$1
  Bottom 0.305: v70.99,96.3 71.34,95.95 71.34,90.52 71.33,90.52 71.33,89.29 70.95,88.91 68.51,88.91 STM32F4/F7.CN11_65
PWDN  (via drill 0.35)
  Top 0.305: CAMERA.18 13.83,94.11 13.83,85.7 v14.63,84.9 | v18.61,50.64 18.61,46.77 17.65,45.81 STM32F4/F7.CN12_31
  Bottom 0.305: v14.63,84.9 19.45,80.09 19.45,51.43 18.66,50.64 v18.61,50.64
RCC_MCO_1  (via drill 0.35)
  Top 0.305: CAMERA.8 25.68,93.36 25.68,85.21 v25.41,84.94 | v21.1,43.95 21.1,40.36 16.39,35.65 STM32F4/F7.CN12_23
  Bottom 0.305: v25.41,84.94 25.37,84.9 25.37,84.67 22.11,81.41 22.11,50.03 22.61,49.52 22.61,45.47 v21.1,43.95
RESET  (via drill 0.35)
  Top 0.305: CAMERA.17 15.05,95.43 15.05,95.39 15.25,95.19 15.25,85.54 v15.89,84.9 | v15.89,84.9 | v19.78,50.59 19.78,41.64 18.87,40.73 STM32F4/F7.CN12_27
  Bottom 0.305: v15.89,84.9 16.37,84.42 16.37,84.4 20,80.77 20,50.81 v19.78,50.59
SDIO_CK  (via drill 0.35)
  Top 0.305: R4.2 37.59,27.1 37.7,26.99 37.7,14.36 39.36,12.7 SDCARD.11 59.46,12.7 63.15,9.01 v63.25,9.01
  Bottom 0.305: v63.25,9.01 63.3,8.96 67.14,8.96 STM32F4/F7.CN11_3
SDIO_CMD  (via drill 0.35)
  Top 0.305: R5.2 39.38,14.83 39.71,14.5 SDCARD.9 60.06,14.5 60.69,13.87 60.69,12.18 62.67,10.2 63.34,10.2 v63.35,10.21
  Bottom 0.305: v63.35,10.21 65.85,10.21 STM32F4/F7.CN11_4
SDIO_D0
  Top 0.305: STM32F4/F7.CN12_2 4.93,7.64 6.26,6.31 21.79,6.31 29.08,13.6 SDCARD.13 31.75,13.6 35.59,17.44 R8.2
SDIO_D1
  Top 0.305: R9.2 34.02,21.06 32.57,19.61 SDCARD.14 29.75,19.61 28.6,18.46 28.6,13.91 22.4,7.71 STM32F4/F7.CN12_1
SDIO_D2
  Top 0.305: R7.2 42.71,21.4 43.14,20.96 SDCARD.7 59.64,20.96 61.6,19.01 61.6,12.66 62.75,11.51 69.3,11.51 70,10.81 70,8.56 69.15,7.71 STM32F4/F7.CN11_1
SDIO_D3
  Top 0.305: R6.2 41.12,20.39 41.95,19.56 43.68,19.56 SDCARD.8 60.04,19.61 61.14,18.51 61.14,12.47 62.56,11.05 64.01,11.05 64.5,10.56 64.5,8.46 65.25,7.71 STM32F4/F7.CN11_2
UDQM  (via drill 0.35)
  Top 0.305: SDRAM.39 v28.19,75.28 v28.18,75.29 | v28.44,84.93 29.02,85.51 29.03,85.51 30.77,87.25 51.59,87.25 56.13,82.7 66.39,82.7 66.39,82.71 67.27,82.71 68.43,83.87 STM32F4/F7.CN11_61
  Bottom 0.305: v28.18,75.29 28.18,84.67 v28.44,84.93

### Text on the board
tPlace: RESET | D1 | D3 | D5 | D7 | PIXCK | VSYN | SCL | 3.3V | GND | GND | GND | GND | PG4 | PG6 | PG11 | PD9 | PG5 | PG7 | D0 | D2 | D4 | D6 | XCK | SDA | GND | PIR | PG13 | PH12 | PWDN | HSYN | PG8 | PD10 | PG10 | PG12 | PE0 | GND | PG15 | PG9 | PF11 | PG14 | PE6 | PE1 | PF15 | PF12 | GND | PG0 | PF3 | PF13 | PG1 | PD0 | PE13 | PD1 | PE11 | PF9 | PH0 | GND | PE15 | PF8 | PF0 | PE14 | PH1 | PE9 | PF2 | PF1 | PF14 | PE12 | PE5 | GND | PE10 | PE4 | PD15 | PE3 | PD14 | PE2 | PD7 | PD11 | PE7 | PD12 | SDRAM | PG3 | PD6 | PF10 | PD13 | PG2 | PD5 | PE8 | GND | PD3 | PD4 | PF4 | PA3 | PC0 | PC3 | PF5 | PA2 | PC1 | PC2 | PB0 | UBAT | PC4 | PA10 | AGND | PB3 | PA4 | OSC0 | PB5 | PA1 | OSC1 | PB13 | AD-HOC | PB14 | PB4 | PA0 | PC15 | PB10 | PB15 | PC14 | PB1 | PA8 | VIN | PC13 | PB2 | PA9 | PB7 | GND | PC7 | GND | GND | PB11 | PB6 | GND | PA15 | PB12 | PA7 | +5V | PA14 | PA11 | PA6 | 3V3 | NRST | PA13 | PA12 | +3V3 | PF7 | PD8 | GND | NC | PF6 | U5V | AVDO | BT0 | GND | PC5 | PB9 | E5V | VDO | PB8 | PC6 | PD2 | PC12 | PC8 | PC9 | PC11 | PC10
tNames: PA5/CARD_DET